# EAGLE design lcdboard (EAGLE 6.4)
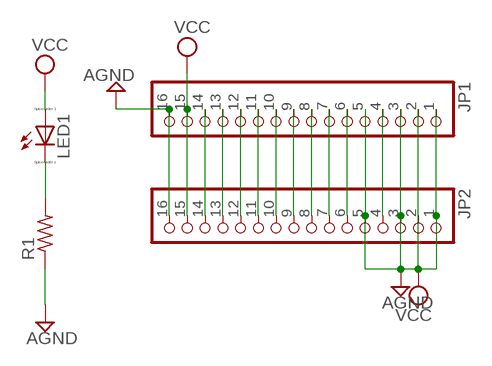
[diagram p0: schematic, sheet 1]

## Parts
JP1  PINHD-1X16/90  [1X16/90]
JP2  PINHD-1X16/90  [1X16/90]
LED1  LED_ELD260  [LED_LD260]
R1  R-US_0204/7  [0204/7]

## Nets
AGND: JP1.1 JP1.3 JP1.5 JP1.16 JP2.1 JP2.3 JP2.5 JP2.16 R1.1
N$1: LED1.K(C) R1.2
N$3: JP1.14 JP2.14
N$4: JP1.13 JP2.13
N$5: JP1.12 JP2.12
N$6: JP1.11 JP2.11
N$7: JP1.10 JP2.10
N$8: JP1.9 JP2.9
N$9: JP1.8 JP2.8
N$10: JP1.7 JP2.7
N$11: JP1.6 JP2.6
N$13: JP1.4 JP2.4
VCC: JP1.2 JP1.15 JP2.2 JP2.15 LED1.A

## Library data of the parts
JP1 JP2 = pinhead:PINHD-1X16: PIN HEADER
LED1 = eagle-ltspice:LED_E: LED Source: http://www.osram.convergy.de Source: www.luxeon.com Source: www.kingbright.com; SPICEMODEL: NONE; SPICEPREFIX: D; SPICETYPE: diode
R1 = rcl:R-US_: RESISTOR, American symbol

## Board
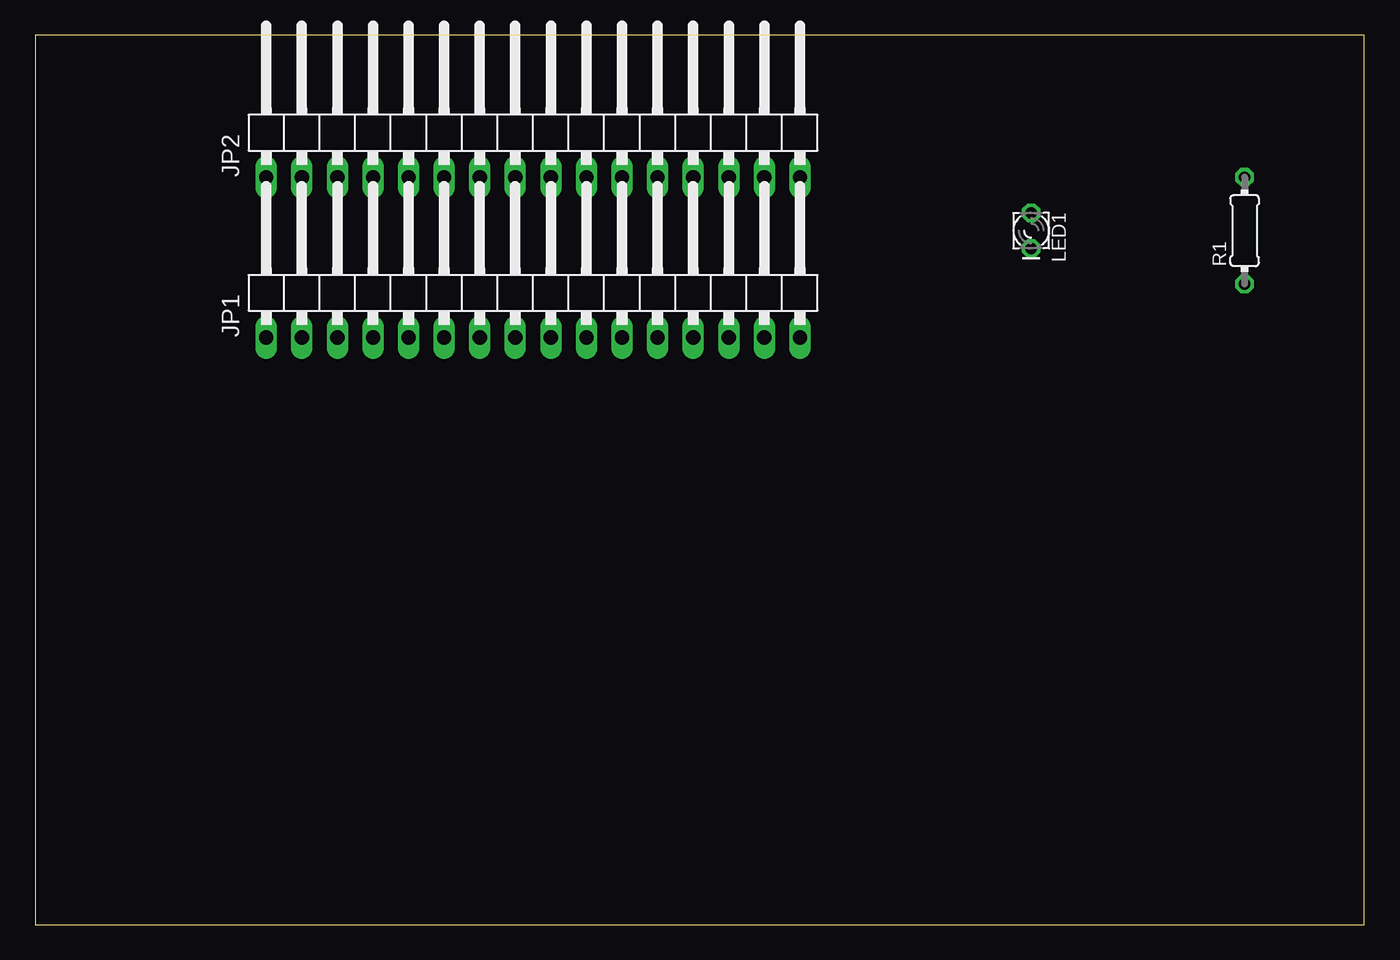
[diagram p1: board, top side]
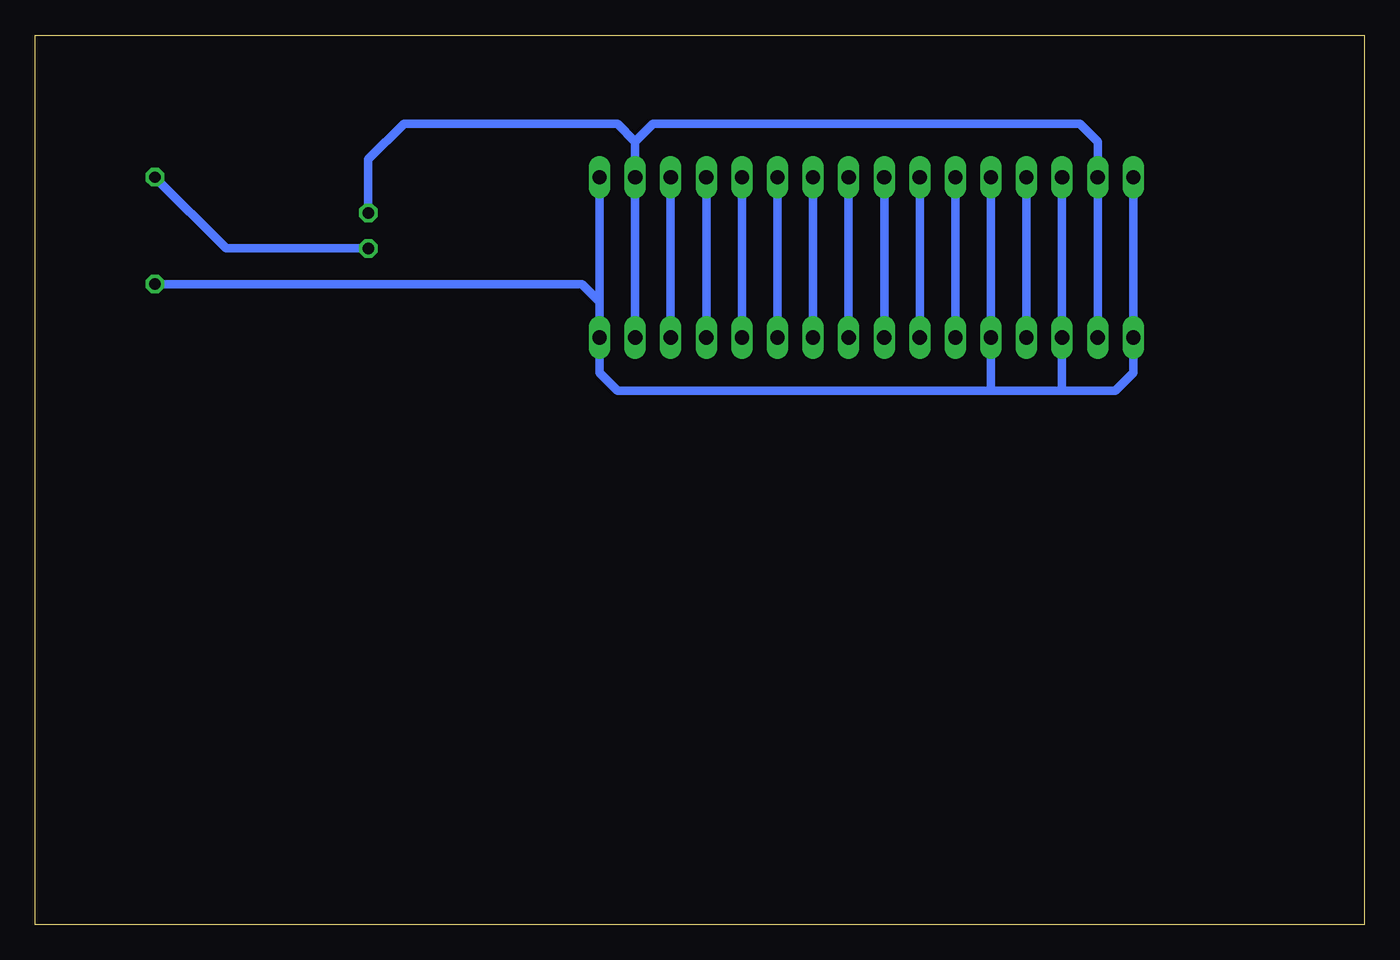
[diagram p2: board, bottom side, seen from below]

Size 94.92 x 63.49 mm. Coordinates in mm from the lower left corner, seen from the top.
Outline: 0,0 94.92,0 94.92,63.49 0,63.49 0,0
Copper layers (1*16): Top 0.035mm / dielectric 1.5mm / Bottom 0.035mm
Design rules "default": minimum track width 10mil, minimum drill 24mil, track to track 8mil, track to pad 8mil, pad to pad 8mil, via to via 8mil, smd to smd 8mil, copper to edge 40mil, drill to drill 8mil, minimum pad ring 10mil, minimum via ring 8mil, stop-mask expansion 4mil, vias tented up to drill 0mil, thermal gap 10mil

### Footprints (pad centres in the part's own frame; a part is rotated, then mirrored left to right if it is on the bottom)
1X16/90 = drill 1.016 long: 1 -19.05,-3.81; 2 -16.51,-3.81; 3 -13.97,-3.81; 4 -11.43,-3.81; 5 -8.89,-3.81; 6 -6.35,-3.81; 7 -3.81,-3.81; 8 -1.27,-3.81; 9 1.27,-3.81; 10 3.81,-3.81; 11 6.35,-3.81; 12 8.89,-3.81; 13 11.43,-3.81; 14 13.97,-3.81; 15 16.51,-3.81; 16 19.05,-3.81
LED_LD260 = drill 0.813 octagon: A -1.27,0; K 1.27,0
0204/7 = drill 0.813 octagon: 1 -3.81,0; 2 3.81,0

### Placement (x,y rotation side)
JP1  35.56,45.72 0 top
JP2  35.56,57.15 0 top
LED1  71.12,49.53 270 top
R1  86.36,49.53 90 top

### Tracks (layer width: path | path; a pad name or v marks a point on that pad's centre or on a via)
AGND
  Bottom 0.406: JP1.16 54.61,44.45
  Bottom 0.61: 54.61,44.45 55.88,45.72 R1.1 | JP2.5 JP1.5 26.67,38.1 | JP1.1 JP2.1 16.51,39.37 17.78,38.1 21.59,38.1 | JP2.16 JP1.16 54.61,39.37 53.34,38.1 26.67,38.1 | 21.59,38.1 JP1.3 JP2.3 | 21.59,38.1 26.67,38.1
N$1
  Bottom 0.61: LED1.K 81.28,48.26 R1.2
N$3
  Bottom 0.61: JP2.14 JP1.14
N$4
  Bottom 0.61: JP2.13 JP1.13
N$5
  Bottom 0.61: JP2.12 JP1.12
N$6
  Bottom 0.61: JP2.11 JP1.11
N$7
  Bottom 0.61: JP2.10 JP1.10
N$8
  Bottom 0.61: JP2.9 JP1.9
N$9
  Bottom 0.61: JP2.8 JP1.8
N$10
  Bottom 0.61: JP2.7 JP1.7
N$11
  Bottom 0.61: JP2.6 JP1.6
N$13
  Bottom 0.61: JP2.4 JP1.4
VCC
  Bottom 0.61: JP1.15 JP2.15 52.07,55.88 | 52.07,55.88 53.34,57.15 68.58,57.15 71.12,54.61 LED1.A | JP1.2 JP2.2 19.05,55.88 20.32,57.15 50.8,57.15 52.07,55.88